# EAGLE design ok-wake (EAGLE 6.1)
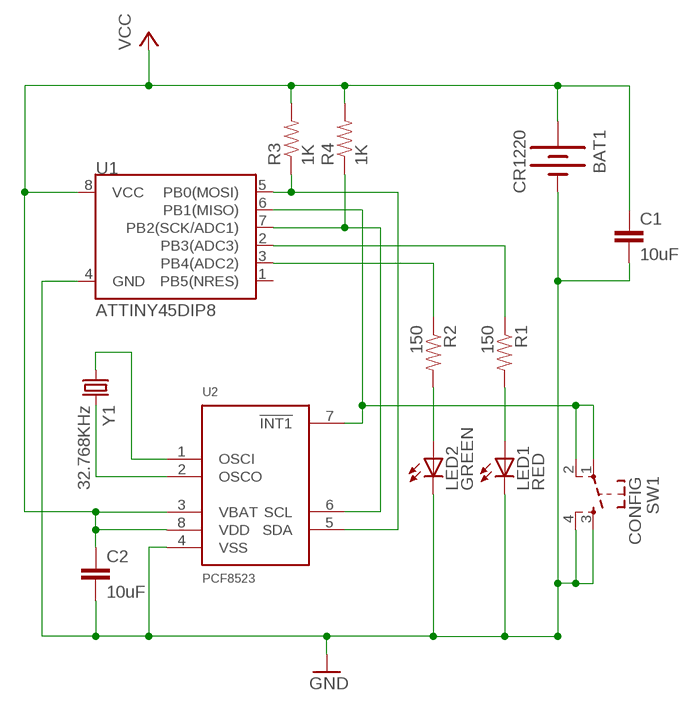
[diagram p0: schematic, sheet 1]

## Parts
BAT1  CR1220  BATTERY12MM  [BATTCON_12MM]
C1  10uF  CAP1206  [1206]
C2  10uF  CAP1206  [1206]
LED1  RED  LEDCHIP-LED0805  [CHIP-LED0805]
LED2  GREEN  LEDCHIP-LED0805  [CHIP-LED0805]
R1  150  RESISTOR0805-RES  [0805]
R2  150  RESISTOR0805-RES  [0805]
R3  1K  RESISTOR0805-RES  [0805]
R4  1K  RESISTOR0805-RES  [0805]
SW1  CONFIG  SW_TACT  [SW_TACT_SMALL]
U1  ATTINY45DIP8  [DIP08]
U2  PCF8523  [SO8]
Y1  32.768KHz  CRYSTAL32-SMD  [CRYSTAL-32KHZ-SMD]

## Nets
!INT1: SW1.1 SW1.2 U1.6(PB1(MISO)) U2.7(!INT1)
GND: BAT1.GND(-) C1.2 C2.2 LED1.C LED2.C SW1.3 SW1.4 U1.4(GND) U2.4(VSS)
LED1-LO: LED1.A R1.2
LED1-OUT: R1.1 U1.2(PB3(ADC3))
LED2-LO: LED2.A R2.2
LED2-OUT: R2.1 U1.3(PB4(ADC2))
OSCI: U2.1(OSCI) Y1.X1
OSCO: U2.2(OSCO) Y1.X2
SCL/SCK: R4.1 U1.7(PB2(SCK/ADC1)) U2.6(SCL)
SDA/MOSI: R3.1 U1.5(PB0(MOSI)) U2.5(SDA)
VCC: BAT1.PWR@1(+) C1.1 C2.1 R3.2 R4.2 U1.8(VCC) U2.3(VBAT) U2.8(VDD)
Unconnected: U1.1(PB5(NRES))

## Library data of the parts
BAT1 = SparkFun:BATTERY: Battery Holders Various common sizes : AA, AAA, 20mm coin cell and 12mm coin cell.
C1 C2 = SparkFun:CAP: Capacitor Standard 0603 ceramic capacitor, and 0.1" leaded capacitor.
LED1 LED2 = adafruit:LED: LED OSRAM: - CHIPLED LG R971, LG N971, LY N971, LG Q971, LY Q971, LO R971, LY R971 LH N974, LH R974 LS Q976, LO Q976, LY Q976 LO Q996 - Hyper CHIPLED LW Q18S LB Q993, LB Q99A, LB R99A - SideLED LS A670, LO A670, LY A670, LG A670, LP A670 LB A673, LV A673, LT A673, LW A673 LH A674 LY A675 LS A676, LA A676, LO A676, LY A676, LW A676 LS A679, LY A679, LG A679 - Hyper Micro SIDELED® LS Y876, LA Y876, LO Y876, LY Y876 LT Y87S - SmartLED LW L88C, LW L88S LB L89C, LB L89S, LG L890 LS L89K, LO L89K, LY L89K LS L896, LA L896, LO L896, LY L896 - TOPLED LS T670, LO T670, LY T670, LG T670, LP T670 LSG T670, LSP T670, LSY T670, LOP T670, LYG T670 LG T671, LOG T671, LSG T671 LB T673, LV T673, LT T673, LW T673 LH T674 LS T676, LA T676, LO T676, LY T676, LB T676, LH T676, LSB T676, LW T676 LB T67C, LV T67C, LT T67C, LS T67K, LO T67K, LY T67K, LW E67C LS E67B, LA E67B, LO E67B, LY E67B, LB E67C, LV E67C, LT E67C LW T67C LS T679, LY T679, LG T679 LS T770, LO T770, LY T770, LG T770, LP T770 LB T773, LV T773, LT T773, LW T773 LH T774 LS E675, LA E675, LY E675, LS T675 LS T776, LA T776, LO T776, LY T776, LB T776 LHGB T686 LT T68C, LB T68C - Hyper Mini TOPLED® LB M676 - Mini TOPLED Santana® LG M470 LS M47K, LO M47K, LY M47K Source: http://www.osram.convergy.de/
R1-R4 = SparkFun:RESISTOR: Resistor Basic schematic elements and footprints for 0603, 1206, and PTH resistors.
SW1 = dp_devices:SW_TACT
U1 = SparkFun:ATTINY45: Atmel ATTiny45
U2 = ok_wake:PCF8523
Y1 = ok_wake:CRYSTAL: Crystals Various standard crystals. Proven footprints. Spark Fun Electronics SKU : COM-00534

## Board
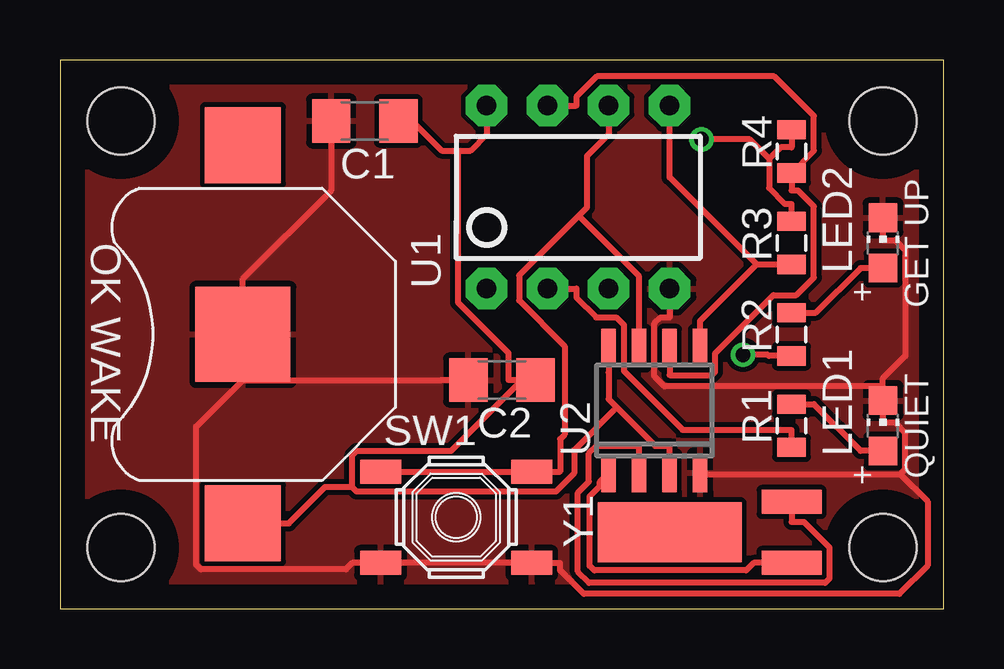
[diagram p1: board, top side]
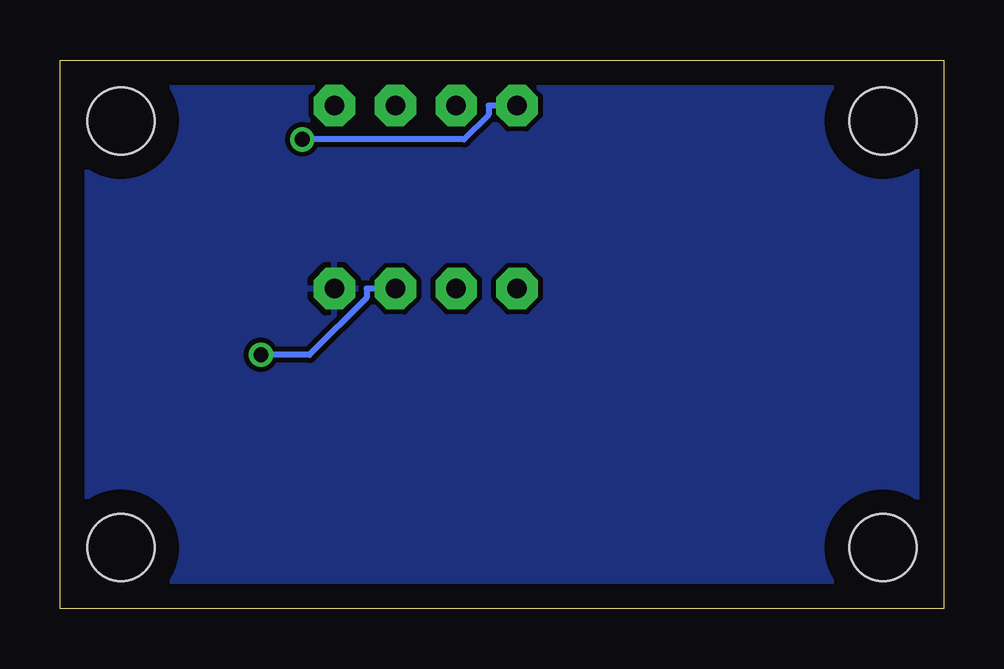
[diagram p2: board, bottom side, seen from below]

Size 36.83 x 22.86 mm. Coordinates in mm from the lower left corner, seen from the top.
Outline: 0,0 36.83,0 36.83,22.86 0,22.86 0,0
Copper layers (1*16): Top 0.035mm / dielectric 1.5mm / Bottom 0.035mm
Design rules: minimum track width 10mil, minimum drill 24mil, track to track 8mil, track to pad 8mil, pad to pad 8mil, via to via 8mil, smd to smd 8mil, copper to edge 40mil, drill to drill 8mil, minimum pad ring 10mil, minimum via ring 8mil, stop-mask expansion 4mil, vias tented up to drill 0mil, thermal gap 10mil
Holes 2.8 mm at 2.54,2.54 2.54,20.32 34.29,20.32 34.29,2.54

### Footprints (pad centres in the part's own frame; a part is rotated, then mirrored left to right if it is on the bottom)
BATTCON_12MM = smd 3.962 x 3.962: GND 0,0 | smd 3.175 x 3.175: PWR@1 -7.874,0; PWR@2 7.874,0
1206 = smd 1.6 x 1.8: 1 -1.4,0; 2 1.4,0
CHIP-LED0805 = smd 1.2 x 1.2: A 0,-1.05; C 0,1.05
0805 = smd 0.8 x 1.2: 1 -0.9,0; 2 0.9,0
SW_TACT_SMALL = smd 1.7 x 1: 1 -3.15,1.9; 2 3.15,1.9; 3 -3.15,-1.9; 4 3.15,-1.9
DIP08 = drill 0.813 pad 1.727 octagon: 1 -3.81,-3.81; 2 -1.27,-3.81; 3 1.27,-3.81; 4 3.81,-3.81; 5 3.81,3.81; 6 1.27,3.81; 7 -1.27,3.81; 8 -3.81,3.81
SO8 = smd 0.6 x 1.6: 1 -1.905,-2.6; 2 -0.635,-2.6; 3 0.635,-2.6; 4 1.905,-2.6; 5 1.905,2.6; 6 0.635,2.6; 7 -0.635,2.6; 8 -1.905,2.6
CRYSTAL-32KHZ-SMD = smd 2.5 x 6: SHEILD 0,5.08 | smd 1 x 2.5: X1 -1.27,0; X2 1.27,0

### Placement (x,y rotation side)
BAT1  7.62,11.43 90 top
C1  12.7,20.32 180 top
C2  18.41,9.53 180 top
LED1  34.29,7.62 0 top
LED2  34.29,15.24 0 top
R1  30.48,7.62 90 top
R2  30.48,11.43 90 top
R3  30.48,15.24 90 top
R4  30.48,19.05 90 top
SW1  16.51,3.81 0 top
U1  21.59,17.14 0 top
U2  24.77,8.26 0 top
Y1  30.48,3.17 90 top

### Tracks (layer width: path | path; a pad name or v marks a point on that pad's centre or on a via)
!INT1
  Top 0.254: 21.61,16.36 19.13,13.88 19.13,12.84 21.03,10.94 21.03,7.25 20.84,7.07 20.84,5.71 SW1.2 SW1.1 | 21.61,16.36 21.95,16.71 21.95,18.85 22.86,19.76 U1.6 | U2.7 24.13,13.84 21.61,16.36
GND
  Top 0.254: 35.02,5.6 36.15,4.47 36.15,1.79 34.97,0.61 21.83,0.61 20.84,1.6 20.84,1.91 SW1.4 SW1.3 12.18,1.91 11.91,1.64 5.87,1.64 5.68,1.83 5.68,7.58 7.62,9.53 | 35.02,5.6 35.22,5.8 35.22,7.32 34.8,7.74 34.29,7.74 LED1.C 34.29,9.08 34.29,9.26 | U2.4 26.73,5.6 35.02,5.6 | C1.2 11.3,17.42 7.62,13.74 BAT1.GND 7.62,9.53 | 7.62,9.53 15.88,9.53 C2.2 | U1.4 25.4,12.14 25.03,12.14 24.77,11.88 24.77,9.67 25.19,9.26 34.29,9.26 | 34.29,9.26 34.29,9.6 35.22,10.53 35.22,14.94 34.8,15.36 34.29,15.36 LED2.C
  pour Bottom: -2.54,25.4 39.37,25.4 39.37,-2.54 -2.54,-2.54
  pour Top: -1.27,24.13 38.1,24.13 38.1,-1.27 -1.27,-1.27
LED1-LO
  Top 0.254: R1.2 31.41,8.52 33.36,6.57 LED1.A
LED1-OUT
  Top 0.254: R1.1 30.48,7.45 25.95,7.45 23.49,9.91 23.49,11.83 23.18,12.14 22.34,12.14 21.51,12.96 21.51,13.34 U1.2
LED2-LO
  Top 0.254: LED2.A 33.36,14.19 31.5,12.33 R2.2
LED2-OUT  (via drill 0.61 pad 1.02)
  Top 0.254: v28.46,10.58 29.5,10.58 29.55,10.53 R2.1
  Bottom 0.254: v28.46,10.58 26.44,10.58 24.05,12.96 24.05,13.34 U1.3
OSCI
  Top 0.254: U2.1 22.49,5.29 22.49,5.1 22.07,4.68 22.07,1.79 22.26,1.59 28.59,1.59 28.9,1.91 Y1.X1
OSCO
  Top 0.254: Y1.X2 30.48,3.62 31,3.62 32.06,2.55 32.06,1.25 31.88,1.07 22.05,1.07 21.58,1.54 21.58,4.83 22.04,5.29 22.04,6.46 22.36,6.79 24.13,6.79 U2.2
SCL/SCK
  Top 0.254: U2.6 25.4,9.72 27.16,9.72 27.3,9.86 27.3,10.64 29.72,13.06 30.68,13.06 31.41,13.79 31.41,16.76 30.75,17.42 30.48,17.42 R4.1 31.41,19.08 31.41,20.53 29.76,22.18 22.37,22.18 21.51,21.33 21.51,20.95 U1.7
SDA/MOSI
  Top 0.254: 29.02,14.34 R3.1 | 29.02,14.34 26.67,11.98 U2.5 | 29.02,14.34 25.4,17.96 U1.5
VCC  (via drill 0.61 pad 1.02)
  Top 0.254: 23.2,8.39 21.42,6.61 21.42,5.64 20.66,4.88 12.36,4.88 12.18,5.06 | 23.2,8.39 22.86,8.72 22.86,9.84 U2.8 | 23.2,8.39 24.8,6.79 25.4,6.79 U2.3 | 12.18,5.06 12.18,6.39 12.36,6.58 16.3,6.58 19.25,9.53 | 12.18,5.06 11.04,5.06 9.54,3.56 BAT1.PWR@1 | 16.58,19.09 17.11,19.09 17.78,19.76 U1.8 | 16.58,19.09 15.9,19.09 14.66,20.32 C1.1 | 16.58,19.09 16.58,12.76 18.68,10.65 18.68,9.53 19.25,9.53 | C2.1 19.25,9.53 | 29.55,18.75 28.74,19.55 v26.74,19.55 | 29.55,18.75 29.55,17.53 30.21,16.87 30.48,16.87 R3.2 | 29.55,18.75 30.02,19.22 30.48,19.22 R4.2
  Bottom 0.254: v26.74,19.55 20,19.55 18.97,20.58 18.97,20.95 U1.8

### Text on the board
tNames: OK WAKE | GET UP | QUIET